# EAGLE design ASD2501 (EAGLE 6.3)
DATABASE: ./../../../../../Components/TinyCircuits_Part_Database.txt
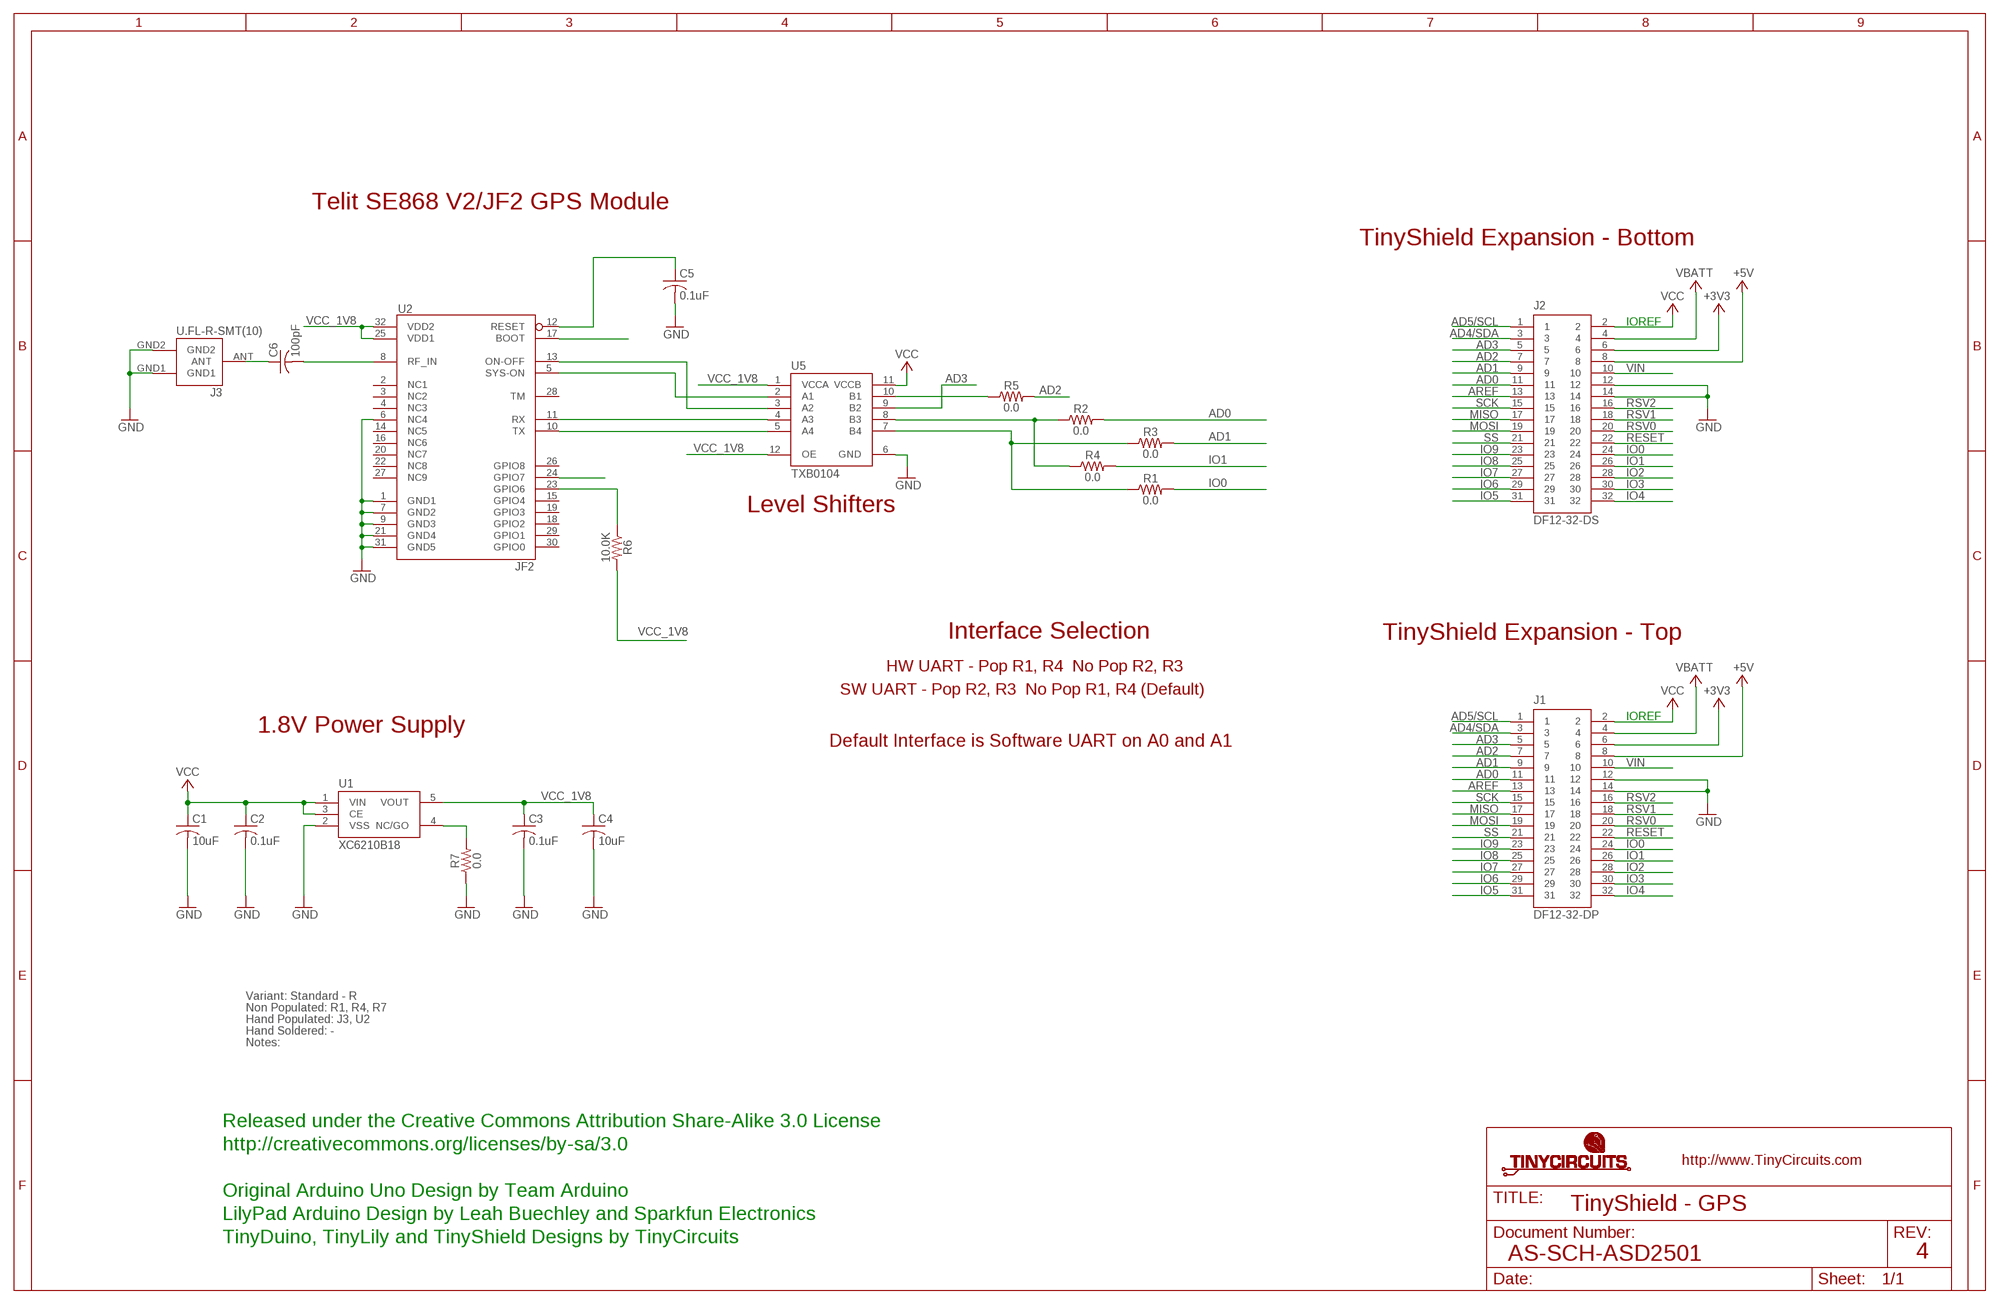
[diagram p0: schematic, sheet 1]

## Parts
C1  10uF  AS-ITM-00045  [C0805]
C2  0.1uF  AS-ITM-00008  [C0402]
C3  0.1uF  AS-ITM-00008  [C0402]
C4  10uF  AS-ITM-00045  [C0805]
C5  0.1uF  AS-ITM-00008  [C0402]
C6  100pF  AS-ITM-00148  [0402]
J1  DF12-32-DP  AS-ITM-00015  [DF12-32-DP]
J2  DF12-32-DS  AS-ITM-00012  [DF12-32-DS]
J3  U.FL-R-SMT(10)  AS-ITM-00193  [U.FL-R-SMT(10)]
R1  0.0  AS-ITM-00076  [0402]
R2  0.0  AS-ITM-00076  [0402]
R3  0.0  AS-ITM-00076  [0402]
R4  0.0  AS-ITM-00076  [0402]
R5  0.0  AS-ITM-00076  [0402]
R6  10.0K  AS-ITM-00032  [0402]
R7  0.0  AS-ITM-00076  [0402]
U1  XC6210B18  AS-ITM-00075  [SOT-25]
U2  JF2  AS-ITM-00077  [JF2]
U5  TXB0104  AS-ITM-00048  [UQFN-12]

## Nets
+3V3: J1.6 J2.6
+5V: J1.8 J2.8
AD0: J1.11 J2.11 R2.2
AD1: J1.9 J2.9 R3.2
AD2: J1.7 J2.7 R5.2
AD3: J1.5 J2.5 U5.9(B2)
AD4/SDA: J1.3 J2.3
AD5/SCL: J1.1 J2.1
AREF: J1.13 J2.13
GND: C1.2 C2.2 C3.2 C4.2 C5.2 J1.12 J1.14 J2.12 J2.14 J3.GND1 J3.GND2 R7.1 U1.2(VSS) U2.1(GND1) U2.6(NC4) U2.7(GND2) U2.9(GND3) U2.21(GND4) U2.31(GND5) U5.6(GND)
IO0: J1.24 J2.24 R1.2
IO1: J1.26 J2.26 R4.2
IO2: J1.28 J2.28
IO3: J1.30 J2.30
IO4: J1.32 J2.32
IO5: J1.31 J2.31
IO6: J1.29 J2.29
IO7: J1.27 J2.27
IO8: J1.25 J2.25
IO9: J1.23 J2.23
MISO: J1.17 J2.17
MOSI: J1.19 J2.19
N$1: C6.1 J3.ANT
N$2: R2.1 R4.1 U5.8(B3)
N$3: R1.1 R3.1 U5.7(B4)
N$4: U2.11(RX) U5.4(A3)
N$5: R6.1 U2.23(GPIO6)
N$6: R7.2 U1.4(NC/GO)
N$7: U2.10(TX) U5.5(A4)
N$8: C5.1 U2.12(RESET)
N$9: C6.2 U2.8(RF_IN)
N$10: U2.17(BOOT)
N$11: U2.13(ON-OFF) U5.3(A2)
N$12: U2.5(SYS-ON) U5.2(A1)
N$13: R5.1 U5.10(B1)
N$14: U2.24(GPIO7)
RESET: J1.22 J2.22
RSV0: J1.20 J2.20
RSV1: J1.18 J2.18
RSV2: J1.16 J2.16
SCK: J1.15 J2.15
SS: J1.21 J2.21
VBATT: J1.4 J2.4
VCC: C1.1 C2.1 J1.2 J2.2 U1.1(VIN) U1.3(CE) U5.11(VCCB)
VCC_1V8: C3.1 C4.1 R6.2 U1.5(VOUT) U2.25(VDD1) U2.32(VDD2) U5.1(VCCA) U5.12(OE)
VIN: J1.10 J2.10
Unconnected: U2.2(NC1) U2.3(NC2) U2.4(NC3) U2.14(NC5) U2.15(GPIO4) U2.16(NC6) U2.18(GPIO2) U2.19(GPIO3) U2.20(NC7) U2.22(NC8) U2.26(GPIO8) U2.27(NC9) U2.28(TM) U2.29(GPIO1) U2.30(GPIO0)

## Notes on the sheet
- Telit SE868 V2/JF2 GPS Module
- TinyShield Expansion - Bottom
- IOREF
- Level Shifters
- Interface Selection | TinyShield Expansion - Top
- HW UART - Pop R1, R4  No Pop R2, R3
- SW UART - Pop R2, R3  No Pop R1, R4 (Default)
- IOREF
- 1.8V Power Supply
- Default Interface is Software UART on A0 and A1
- Variant: Standard - R
- Non Populated: R1, R4, R7
- Hand Populated: J3, U2
- Hand Soldered: -
- Notes:
- Released under the Creative Commons Attribution Share-Alike 3.0 License
- http://creativecommons.org/licenses/by-sa/3.0
- Original Arduino Uno Design by Team Arduino
- TinyShield - GPS
- LilyPad Arduino Design by Leah Buechley and Sparkfun Electronics
- TinyDuino, TinyLily and TinyShield Designs by TinyCircuits
- AS-SCH-ASD2501 | 4

## Library data of the parts
C1 C4 = tinycircuits:AS-ITM-00045: CAP CER 16UF 16V 20% X5R 0805; PARTNO: AS-ITM-00045
C2 C3 C5 = tinycircuits:AS-ITM-00008: CAP CER 0.1UF 16V 10% X5R 0402; PARTNO: AS-ITM-00008
C6 = tinycircuits:AS-ITM-00148: CAP CER 100PF 50V 5% NPO 0402; PARTNO: AS-ITM-00148
J1 = tinycircuits:AS-ITM-00015: CONN HEADER 32POS 3MM SMD 0.5MM; PARTNO: AS-ITM-00015
J2 = tinycircuits:AS-ITM-00012: CONN RECEPT 32POS 3MM SMD 0.5MM; PARTNO: AS-ITM-00012
J3 = tinycircuits:AS-ITM-00193: RF COAXIAL CONNECTOR U.FL RECEPTACLE SMT; PARTNO: AS-ITM-00193
R1-R5 R7 = tinycircuits:AS-ITM-00076: RES 0.0 OHM 1/16W 1% 0402 SMD; PARTNO: AS-ITM-00076
R6 = tinycircuits:AS-ITM-00032: RES 10.0K OHM 1/16W 1% 0402 SMD; PARTNO: AS-ITM-00032
U1 = tinycircuits:AS-ITM-00075: IC REG LDO 1.8V .7A SOT-25; PARTNO: AS-ITM-00075; PNPROTATION: 270
U2 = tinycircuits:AS-ITM-00077: Telit JF2 GPS Module; PARTNO: AS-ITM-00077
U5 = tinycircuits:AS-ITM-00048: IC VOLT-LEVEL TRANSLATOR 12UQFN; PARTNO: AS-ITM-00048; PNPROTATION: 0

## Board
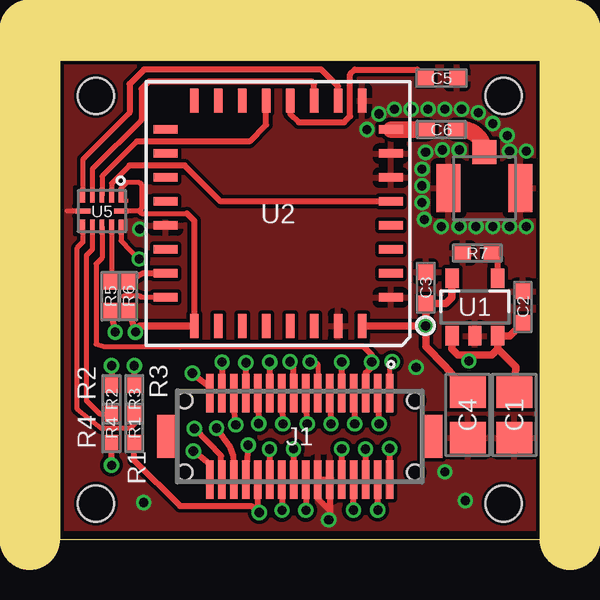
[diagram p1: board, top side]
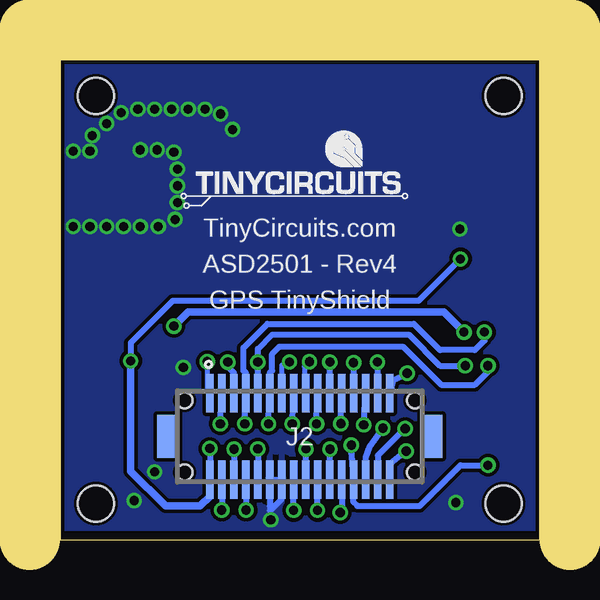
[diagram p2: board, bottom side, seen from below]

Size 20 x 20 mm. Coordinates in mm from the lower left corner, seen from the top.
Outline: 0,20 20,20 20,0 0,0 0,20
Copper layers (1*16): Top 0.035mm / dielectric 1.5mm / Bottom 0.035mm
Design rules "default *": minimum track width 8mil, minimum drill 15mil, track to track 6mil, track to pad 6mil, pad to pad 6mil, via to via 6mil, smd to smd 6mil, copper to edge 6mil, drill to drill 8mil, minimum pad ring 10mil, minimum via ring 5mil, stop-mask expansion 4mil, vias tented up to drill 25mil, thermal gap 10mil
Holes 1.5 mm at 1.5,18.5 18.5,18.5 18.5,1.5 1.5,1.5
tRestrict: 1 lines
bRestrict: 1 lines
Milling: 3 lines

### Footprints (pad centres in the part's own frame; a part is rotated, then mirrored left to right if it is on the bottom)
C0805 = smd 1.3 x 1.5: 1 -0.95,0; 2 0.95,0
C0402 = smd 0.65 x 0.6: 1 -0.65,0; 2 0.65,0
0402 = smd 0.65 x 0.55: 1 -0.6,0; 2 0.6,0
DF12-32-DP = smd 0.3 x 1.6: 1 -3.75,-1.8; 2 -3.75,1.8; 3 -3.25,-1.8; 4 -3.25,1.8; 5 -2.75,-1.8; 6 -2.75,1.8; 7 -2.25,-1.8; 8 -2.25,1.8; 9 -1.75,-1.8; 10 -1.75,1.8; 11 -1.25,-1.8; 12 -1.25,1.8; 13 -0.75,-1.8; 14 -0.75,1.8; 15 -0.25,-1.8; 16 -0.25,1.8; 17 0.25,-1.8; 18 0.25,1.8; 19 0.75,-1.8; 20 0.75,1.8; 21 1.25,-1.8; 22 1.25,1.8; 23 1.75,-1.8; 24 1.75,1.8; 25 2.25,-1.8; 26 2.25,1.8; 27 2.75,-1.8; 28 2.75,1.8; 29 3.25,-1.8; 30 3.25,1.8; 31 3.75,-1.8; 32 3.75,1.8 | smd 0.9 x 1.8: F1 -5.5,0; F2 5.5,0 | hole 0.65: -4.8,1.5; 4.8,1.5
DF12-32-DS = smd 0.3 x 1.6: 1 -3.75,1.8; 2 -3.75,-1.8; 3 -3.25,1.8; 4 -3.25,-1.8; 5 -2.75,1.8; 6 -2.75,-1.8; 7 -2.25,1.8; 8 -2.25,-1.8; 9 -1.75,1.8; 10 -1.75,-1.8; 11 -1.25,1.8; 12 -1.25,-1.8; 13 -0.75,1.8; 14 -0.75,-1.8; 15 -0.25,1.8; 16 -0.25,-1.8; 17 0.25,1.8; 18 0.25,-1.8; 19 0.75,1.8; 20 0.75,-1.8; 21 1.25,1.8; 22 1.25,-1.8; 23 1.75,1.8; 24 1.75,-1.8; 25 2.25,1.8; 26 2.25,-1.8; 27 2.75,1.8; 28 2.75,-1.8; 29 3.25,1.8; 30 3.25,-1.8; 31 3.75,1.8; 32 3.75,-1.8 | smd 0.9 x 1.8: F1 -5.5,0; F2 5.5,0 | hole 0.65: -4.8,1.5; 4.8,1.5
U.FL-R-SMT(10) = smd 1 x 1: ANT 0,-1.5 | smd 1 x 2: GND1 -1.5,0; GND2 1.5,0
SOT-25 = smd 0.55 x 0.8: 1 -0.95,-1.2; 2 0,-1.2; 3 0.95,-1.2; 4 0.95,1.2; 5 -0.95,1.2
JF2 = smd 1 x 0.35: 1 -4.7,3.5; 2 -4.7,2.5; 3 -4.7,1.5; 4 -4.7,0.5; 5 -4.7,-0.5; 6 -4.7,-1.5; 7 -4.7,-2.5; 8 -4.7,-3.5; 17 4.7,-3.5; 18 4.7,-2.5; 19 4.7,-1.5; 20 4.7,-0.5; 21 4.7,0.5; 22 4.7,1.5; 23 4.7,2.5; 24 4.7,3.5 | smd 0.35 x 1: 9 -3.5,-4.7; 10 -2.5,-4.7; 11 -1.5,-4.7; 12 -0.5,-4.7; 13 0.5,-4.7; 14 1.5,-4.7; 15 2.5,-4.7; 16 3.5,-4.7; 25 3.5,4.7; 26 2.5,4.7; 27 1.5,4.7; 28 0.5,4.7; 29 -0.5,4.7; 30 -1.5,4.7; 31 -2.5,4.7; 32 -3.5,4.7
UQFN-12 = smd 0.2 x 0.6: 1 -0.8,-0.65; 2 -0.4,-0.65; 3 0,-0.65; 4 0.4,-0.65; 5 0.8,-0.65; 7 0.8,0.65; 8 0.4,0.65; 9 0,0.65; 10 -0.4,0.65; 11 -0.8,0.65 | smd 0.6 x 0.2: 6 0.8,0; 12 -0.8,0

### Placement (x,y rotation side)
C1  18.95,5.2 270 top
C2  19.3,9.7 90 top
C3  15.25,10.5 90 top
C4  17,5.2 270 top
C5  15.91,19.24 0 top
C6  15.9,17.1 180 top
J1  10,4.3 180 top
J2  10,4.3 0 bottom
J3  17.7,14.65 180 top
R1  3.1,4.65 270 top
R2  2.15,5.85 90 top
R3  3.1,5.85 90 top
R4  2.15,4.65 270 top
R5  2.1,10.15 270 top
R6  2.85,10.15 270 top
R7  17.4,11.95 0 top
U1  17.3,9.7 0 top
U2  9.1,13.6 180 top
U5  1.75,13.7 180 top
U$1  [DOCFIELD-TINYCIRCUITS-PCB]  33.91,-10 0 top  (outside the outline)

### Tracks (layer width: path | path; a pad name or v marks a point on that pad's centre or on a via)
+3V3  (via drill 0.38)
  Top 0.254: J2.6 v12.75,3.77 v12.74,3.77
  Bottom 0.254: v12.74,3.77 12.74,2.51 J2.6
+5V  (via drill 0.38)
  Top 0.254: v12.24,1.23 J2.8
  Bottom 0.254: J2.8 12.25,1.21 v12.24,1.23
AD0  (via drill 0.38)
  Top 0.254: v11.3,4.83 11.31,5.05 J2.11 | v2.15,7.25 R2.2
  Bottom 0.203: J2.11 11.22,6.1
  Bottom 0.254: J2.11 11.28,5.79 v11.3,4.83 | v2.15,7.25 2.15,7 2.7,6.45 4.1,6.45 5.7,8.05 10.85,8.05 11.15,7.75 11.15,7.05 11.25,6.95 11.25,6.13 11.22,6.1
AD1  (via drill 0.38)
  Top 0.254: J2.9 v11.75,7.4 | v3.1,7.25 R3.2
  Bottom 0.254: J2.9 v11.75,7.4 11.75,7.95 11.15,8.55 5.45,8.55 4.15,7.25 v3.1,7.25
AD2  (via drill 0.38)
  Top 0.203: J2.7
  Top 0.254: v12.29,4.83 12.31,5.05 J2.7 | R5.2 v2.3,8.65
  Bottom 0.254: v12.29,4.83 12.27,5.86 J2.7 12.25,6.95 12.35,7.05 12.35,8 11.35,9 5.25,9 4.15,7.9 2.7,7.9 2.3,8.3 v2.3,8.65
AD3  (via drill 0.38)
  Top 0.203: U5.9 1.75,11.75 1.5,11.5 1.5,8.15 1.85,8.05 5,8.05
  Top 0.254: J2.5 12.75,6.95 13,7.2 v13,7.4 13,7.7 12.65,8.05 5,8.05
  Bottom 0.203: 12.75,6.44 J2.5 12.71,6.14
  Bottom 0.254: J2.5 12.75,6.95 13,7.2 v13,7.4
AD4/SDA  (via drill 0.38)
  Top 0.254: v13.31,4.83 13.31,5 J2.3
  Bottom 0.254: J2.3 13.28,5.86 v13.31,4.83
AD5/SCL  (via drill 0.38)
  Top 0.203: J2.1 13.75,7.31 v13.86,7.42
  Bottom 0.203: v13.86,7.42 13.86,6.21 J2.1
AREF  (via drill 0.38)
  Top 0.203: v10.43,7.4 10.75,7.33 10.75,7.27 J2.13
  Bottom 0.203: J2.13 10.75,7.27 v10.43,7.4
GND  (via drill 0.38)
  Top 0.203: U5.6 0.3,13.7
  Top 0.254: J2.12 J2.14 10.75,1.7 11.25,1.2 | J2.12 11.25,1.04 11.21,1 v11.21,0.82 | v11.21,0.82 11.21,0.79 11.23,0.77 | J2.12 11.25,0.86 v11.21,0.82
  Bottom 0.254: J2.14 J2.12 11.25,1.79 11.25,1.4 11.25,1.2 | 11.25,1.2 11.25,0.86 v11.21,0.82 | 10.75,1.7 11.25,1.2
  other vias: 3.48,1.54 16.9,1.62 3.33,12.94 18.75,13.05 15.1,14.05 15.1,14.75 15.1,15.45 14.85,7.17 16.05,2.82 16.65,16.25 15.95,16.25 15.25,16.15 15.2,13.35 15.9,13.05 16.65,13.05 17.35,13.05 18.05,13.05 19.45,13.05 13.3,17.75 13.95,17.95 15.35,17.95 16.05,17.95 16.75,17.95 17.45,17.8 18.05,17.35 18.65,16.85 14.65,17.95 18.75,16.2 19.45,16.2 12.8,17.1
  pour Top: 0,20 20,20 20,0 0,0
  pour Bottom: 0,20 20,20 20,0 0,0
IO0  (via drill 0.38)
  Top 0.254: J2.24 8.25,1 v8.31,1.12 7.99,1.4 5,1.4 3.1,3.3 R1.2
  Bottom 0.254: J2.24 8.24,1.2 v8.31,1.12 8.19,1
IO1  (via drill 0.38)
  Top 0.254: v7.85,3.94 J2.26 | v2.15,3.1 R4.2
  Bottom 0.254: J2.26 7.85,3.66 | J2.26 v7.85,3.94 | J2.26 7.78,2.47 7.78,1.58 7.6,1.4 5,1.4 3.3,3.1 v2.15,3.1
IO2  (via drill 0.38)
  Top 0.254: v6.53,4.64 7.07,3.89 7.22,3.49 7.29,2.61 7.26,2.51 J2.28
  Bottom 0.254: J2.28 7.24,3.43 7.07,3.88 v6.53,4.64
IO3  (via drill 0.38)
  Top 0.254: J2.30 6.73,3.49 v5.61,4.63
  Bottom 0.254: v5.61,4.63 6.75,3.51 6.77,2.53 J2.30
IO4  (via drill 0.38)
  Top 0.254: J2.32 6.25,3.14 v5.56,3.69
  Bottom 0.254: v5.56,3.69 5.61,3.65 6.21,3.18 6.21,3.14 6.26,3.1 J2.32
IO5  (via drill 0.38)
  Top 0.254: v5.52,6.94 6.23,6.38 J2.31
  Bottom 0.254: J2.31 6.11,6.64 v5.52,6.94
IO6  (via drill 0.38)
  Top 0.254: J2.29 6.76,6.11 v6.76,7.4
  Bottom 0.254: J2.29 6.75,7.39 v6.76,7.4
IO7  (via drill 0.38)
  Top 0.254: v7.33,4.78 7.31,4.9 J2.27
  Bottom 0.254: J2.27 7.29,5.76 v7.33,4.78
IO8  (via drill 0.38)
  Top 0.254: J2.25 v7.75,7.37
  Bottom 0.254: v7.75,7.37 J2.25
IO9  (via drill 0.38)
  Top 0.254: v8.29,4.83 8.31,4.98 J2.23
  Bottom 0.254: J2.23 8.28,5.59 v8.29,4.83
MISO  (via drill 0.38)
  Top 0.254: J2.17 9.75,7.29 v9.59,7.42
  Bottom 0.203: v9.59,7.42 9.56,7.33 9.8,7.21 9.8,6.15 J2.17
  Bottom 0.254: 9.74,6.11 J2.17
MOSI  (via drill 0.38)
  Top 0.254: v9.3,4.83 9.31,4.95 J2.19
  Bottom 0.254: J2.19 9.27,5.76 v9.3,4.83
N$1
  Top 0.686: C6.1 16.75,17.1 arc-90 J3.ANT
N$2
  Top 0.203: U5.8 1.35,12.1 1.1,11.85 1.1,5.8 1.65,5.25 R4.1
N$3
  Top 0.203: U5.7 0.95,12.4 0.7,12.15 0.7,5.45 1.7,4.65 2.95,4.65 3.1,4.8 R1.1
N$4
  Top 0.203: 3.4,17.5 1.35,15.45 U5.4
  Top 0.254: U2.11 10.6,19 10.5,19.1 3.7,19.1 3.4,18.8 3.4,17.5
N$5
  Top 0.254: U2.23 3.45,11.1 R6.1
N$6
  Top 0.254: U1.4 18.25,11.7 R7.2
N$7
  Top 0.203: 2.9,17.8 0.95,15.85 U5.5
  Top 0.254: U2.10 11.6,18.9 10.9,19.6 3.5,19.6 2.9,19 2.9,17.8
N$8
  Top 0.254: U2.12 9.6,17.75 9.95,17.4 11.85,17.4 12.1,17.65 12.1,19.4 12.3,19.6 14.9,19.6 C5.1
N$9
  Top 0.686: U2.8 C6.2
N$11
  Top 0.203: 3.2,16.6 1.75,15.15 U5.3
  Top 0.254: 3.2,16.6 7.9,16.6 8.6,17.3 U2.13
N$12
  Top 0.203: 2.9,15.6 2.15,14.85 U5.2
  Top 0.254: U2.5 6.7,14.1 5.2,15.6 2.9,15.6
N$13
  Top 0.203: U5.10 2.15,10.95 R5.1
N$14
  Top 0.203: U2.24 3.4,10.1 3.35,10.15 2.65,10.15
RESET  (via drill 0.38)
  Top 0.254: v8.74,3.77 J2.22
  Bottom 0.254: J2.22 8.75,3.69 v8.74,3.77
RSV0  (via drill 0.38)
  Top 0.254: J2.20 9.25,1.2 v9.26,1.22
  Bottom 0.254: v9.26,1.22 J2.20
RSV1  (via drill 0.38)
  Top 0.254: v9.74,3.77 9.74,2.51 J2.18
  Bottom 0.254: J2.18 9.75,3.72 v9.74,3.77
RSV2  (via drill 0.38)
  Top 0.254: J2.16 10.25,1.16 v10.25,1.22
  Bottom 0.254: v10.25,1.22 J2.16
SCK  (via drill 0.38)
  Top 0.254: v10.31,4.83 10.31,4.98 J2.15
  Bottom 0.254: J2.15 10.29,5.66 v10.31,4.83
SS  (via drill 0.38)
  Top 0.254: v8.75,7.4 J2.21
  Bottom 0.254: J2.21 v8.75,7.39 v8.75,7.4
VBATT  (via drill 0.38)
  Top 0.254: v13.25,1.23 J2.4
  Bottom 0.254: J2.4 13.25,1.24 v13.25,1.23
VCC  (via drill 0.38)
  Top 0.203: U5.11 2.55,12.45 3.3,11.65 v3.3,11.7
  Top 0.254: J2.2 v13.75,3.8
  Top 0.305: U1.1 16.35,7.95 16.6,7.7 17.05,7.7 | 17.05,7.7 18,7.7 18.25,7.95 | 18.25,7.95 U1.3 18.75,8.5 C2.1 | C1.1 19,7.2 18.25,7.95 | v17.05,7.45 17.05,7.7
  Bottom 0.254: v3.3,11.7 5.05,9.95 15.3,9.95 17.05,8.2 v17.05,7.45 | v13.75,3.8 J2.2
  Bottom 0.305: v17.05,7.45 17.05,2.85 15.6,1.4 14.15,1.4 13.75,1.8 J2.2
VCC_1V8  (via drill 0.38)
  Top 0.203: 3.3,13.7 3.4,13.8 3.4,14.8 3.3,14.9 2.8,14.9 2.55,14.65 U5.1 | 3.3,13.7 U5.12 | 3.3,13.7 3.4,13.6 5.3,13.6
  Top 0.254: 5.3,13.6 5.6,13.3 U2.25 | R6.2 v3.15,8.65
  Top 0.305: C4.1 16.06,7.24 15.25,8.05 v15.25,8.9 | U2.25 3.35,8.9 v3.15,8.65 | v15.25,8.9 C3.1 16.1,9.85 16.35,10.1 U1.5 | U2.32 v15.25,8.9
  Bottom 0.305: v15.25,8.9 14.65,9.5 4,9.5 v3.15,8.65
VIN  (via drill 0.38)
  Top 0.254: J2.10 v11.76,3.78 v11.75,3.78
  Bottom 0.254: v11.75,3.78 J2.10

### Text on the board
tPlace: R2 | R3 | R4 | R1
bPlace: TinyCircuits.com | ASD2501 - Rev4 | GPS TinyShield
tRestrict: ^ V-SCORE EDGE ALONG OUTLINE ^
Document: FABRICATION DRAWING | NOTES: | 1. PRINTED CIRCUIT BOARD MADE FROM NEMA GRADE FR-4 EPOXY LAMINATE | WITH 1 OUNCE COPPER PLATING AND .024 THICKNESS. | 2. ALL DIMENSIONS ARE GIVEN IN INCHES. | 3. CIRCUIT PATHS ARE FOR REFERENCE ONLY. | 4. HOLE SIZES SHOWN ARE FINISHED DIAMETERS AFTER PLATING. | 5. BOARD PLATED USING REFLOW OR SIMILAR METHOD. | 6. BOARD TO HAVE BLUE SOLDER MASK ON PLATED SURFACES USING WET FILM | 7. SILKSCREEN BOARD USING WHITE INK. | SR100 OR SR1010 EPOXY. EQUIVALENT WET OR DRY FILM MAY BE USED. | 8. THE FOLLOWING INFORMATION APPLIES TO THIS BOARD: | * 2 COPPER LAYERS | * .024 BOARD THICKNESS | * REQUIRES TOP SIDE SILKSCREEN | Released under the Creative Commons Attribution Share-Alike 3.0 License | http://creativecommons.org/licenses/by-sa/3.0 | Original Arduino Uno Design by Team Arduino | LilyPad Arduino Design by Leah Buechley and Sparkfun Electronics | TinyDuino, TinyLily and TinyShield Designs by TinyCircuits | TinyShield - GPS | AS-PCB-ASD2501 | 4